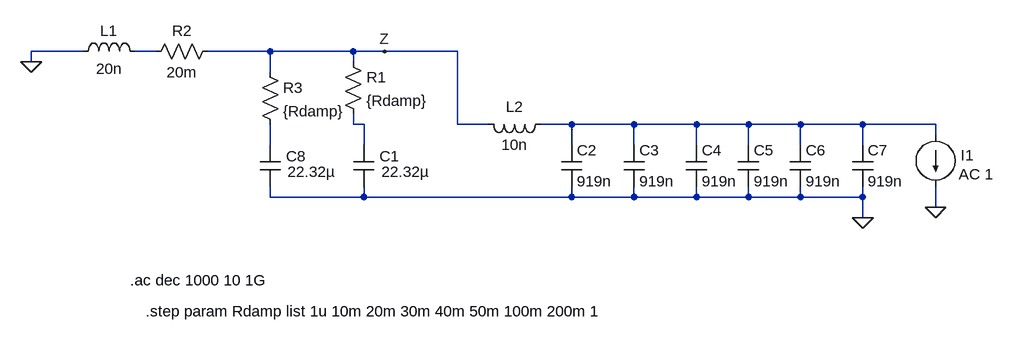
[diagram p0: schematic Draft2.asc]
Draft2.asc, the LTspice schematic file:
Version 4
SHEET 1 1052 680
WIRE -352 -32 -432 -32
WIRE -240 -32 -272 -32
WIRE -64 -32 -160 -32
WIRE 64 -32 -64 -32
WIRE 112 -32 64 -32
WIRE 224 -32 112 -32
WIRE -432 -16 -432 -32
WIRE 64 -16 64 -32
WIRE -64 0 -64 -32
WIRE 64 80 64 64
WIRE 80 80 64 80
WIRE 224 80 224 -32
WIRE 272 80 224 80
WIRE 400 80 352 80
WIRE 496 80 400 80
WIRE 592 80 496 80
WIRE 672 80 592 80
WIRE 752 80 672 80
WIRE 848 80 752 80
WIRE 960 80 848 80
WIRE 960 96 960 80
WIRE -64 112 -64 80
WIRE 80 112 80 80
WIRE 400 112 400 80
WIRE 496 112 496 80
WIRE 592 112 592 80
WIRE 672 112 672 80
WIRE 752 112 752 80
WIRE 848 112 848 80
WIRE -64 192 -64 176
WIRE 80 192 80 176
WIRE 80 192 -64 192
WIRE 400 192 400 176
WIRE 400 192 80 192
WIRE 496 192 496 176
WIRE 496 192 400 192
WIRE 592 192 592 176
WIRE 592 192 496 192
WIRE 672 192 672 176
WIRE 672 192 592 192
WIRE 752 192 752 176
WIRE 752 192 672 192
WIRE 848 192 848 176
WIRE 848 192 752 192
WIRE 960 208 960 176
WIRE 848 224 848 192
FLAG 848 224 0
FLAG 112 -32 Z
FLAG 960 208 0
FLAG -432 -16 0
SYMBOL cap 64 112 R0
WINDOW 0 40 17 Left 2
WINDOW 3 43 41 Left 2
SYMATTR InstName C1
SYMATTR Value 22.32µ
SYMATTR SpiceLine Rser=3m Lser=1.2n
SYMBOL cap 384 112 R0
SYMATTR InstName C2
SYMATTR Value 919n
SYMATTR SpiceLine Rser=10.9m Lser=372p
SYMBOL cap 480 112 R0
SYMATTR InstName C3
SYMATTR Value 919n
SYMATTR SpiceLine Rser=10.9m Lser=372p
SYMBOL cap 576 112 R0
SYMATTR InstName C4
SYMATTR Value 919n
SYMATTR SpiceLine Rser=10.9m Lser=372p
SYMBOL cap 656 112 R0
SYMATTR InstName C5
SYMATTR Value 919n
SYMATTR SpiceLine Rser=10.9m Lser=372p
SYMBOL cap 736 112 R0
SYMATTR InstName C6
SYMATTR Value 919n
SYMATTR SpiceLine Rser=10.9m Lser=372p
SYMBOL cap 832 112 R0
SYMATTR InstName C7
SYMATTR Value 919n
SYMATTR SpiceLine Rser=10.9m Lser=372p
SYMBOL current 960 96 R0
WINDOW 0 39 32 Left 2
WINDOW 3 36 61 Left 2
SYMATTR InstName I1
SYMATTR Value AC 1
SYMBOL cap -80 112 R0
WINDOW 0 40 17 Left 2
WINDOW 3 43 41 Left 2
SYMATTR InstName C8
SYMATTR Value 22.32µ
SYMATTR SpiceLine Rser=3m Lser=1.2n
SYMBOL res 48 -32 R0
SYMATTR InstName R1
SYMATTR Value {Rdamp}
SYMBOL res -144 -48 R90
WINDOW 0 0 56 VBottom 2
WINDOW 3 32 56 VTop 2
SYMATTR InstName R2
SYMATTR Value 20m
SYMBOL ind -368 -16 R270
WINDOW 0 32 56 VTop 2
WINDOW 3 5 56 VBottom 2
SYMATTR InstName L1
SYMATTR Value 20n
SYMBOL res -80 -16 R0
SYMATTR InstName R3
SYMATTR Value {Rdamp}
SYMBOL ind 368 64 R90
WINDOW 0 5 56 VBottom 2
WINDOW 3 32 56 VTop 2
SYMATTR InstName L2
SYMATTR Value 10n
TEXT -280 320 Left 2 !.ac dec 1000 10 1G
TEXT -256 368 Left 2 !.step param Rdamp list 1u 10m 20m 30m 40m 50m 100m 200m 1

The netlist it stands for:
* Draft2.asc
C1 N002 0 22.32µ Rser=3m Lser=1.2n
C2 N003 0 919n Rser=10.9m Lser=372p
C3 N003 0 919n Rser=10.9m Lser=372p
C4 N003 0 919n Rser=10.9m Lser=372p
C5 N003 0 919n Rser=10.9m Lser=372p
C6 N003 0 919n Rser=10.9m Lser=372p
C7 N003 0 919n Rser=10.9m Lser=372p
I1 N003 0 AC 1
C8 N004 0 22.32µ Rser=3m Lser=1.2n
R1 Z N002 {Rdamp}
R2 Z N001 20m
L1 0 N001 20n
R3 Z N004 {Rdamp}
L2 N003 Z 10n
.ac dec 1000 10 1G
.step param Rdamp list 1u 10m 20m 30m 40m 50m 100m 200m 1
.backanno
.end